# Altium schematic sheet BuckConverter.SchDoc
size A4; SheetNumber: 1; SheetTotal: 1
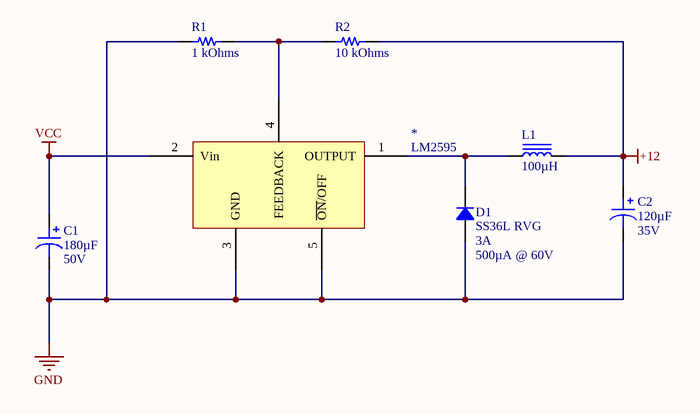
[diagram p0: BuckConverter.SchDoc]

## Parts
*  LM2595  [D2PAK]
C1  180µF  Voltage - Rated: 50V  [CAP ALSMD 8.3MM H10.5MM]
C2  120µF  Voltage - Rated: 35V  [CAP ALSMD 6.6MM H8.0MM]
D1  SS36L RVG  Current - Average Rectified (Io): 3A  Current - Reverse Leakage @ Vr: 500µA @ 60V  [SMF DO-219AB]
L1  100µH  [BOURNS SRR1280]
R1  1 kOhms  [RES 1206_3216]
R2  10 kOhms  [RES 1206_3216]

## Nets
+12: C2.1 L1.2 R2.2
GND: *.3(GND) *.5(~{ON}/OFF) C1.2 C2.2 D1.1 R1.1
VCC: *.2(Vin) C1.1
Net*_1: *.1(OUTPUT) D1.2 L1.1
Net*_4: *.4(FEEDBACK) R1.2 R2.1

## Library data of the parts
C1 = EEE-FK1H181SP: CAP ALUM 180UF 20% 50V SMD; Manufacturer: Panasonic Electronic Components; ESR (Equivalent Series Resistance): 340mOhm @ 100kHz; Lifetime @ Temp.: 2000 Hrs @ 105°C; Polarization: Polar; Ripple Current @ Low Frequency: 227.5mA @ 120Hz; Surface Mount Land Size: 0.327" L x 0.327" W (8.30mm x 8.30mm); Part Number: EEE-FK1H181SP; Applications: Automotive; Capacitance: 180µF; ComponentLink1Description: Datasheet; ComponentLink1URL: https://b2b-api.panasonic.eu/file_stream/pids/fileversion/3102; ComponentLink2Description: DigiKey Link; ComponentLink2URL: http://digikey.com/product-detail/en/panasonic-electronic-components/EEE-FK1H181SP/P18966CT-ND/5805073; Device Package: Radial, Can - SMD; Height - Seated (Max): 0.413" (10.50mm); LastUpdated: 2.09.2020 01:25:13; Lifecycle Status: Active; Minimum Order: 1; Mounting Type: Surface Mount; Operating Temperature: -55°C ~ 105°C; Package / Case: Radial, Can - SMD; Packaging: TapeAndReel; PartId: 7743; Part Status: Active; Price: 0.32; Ratings: AEC-Q200; Series: FKS; Size / Dimension: 0.315" Dia (8.00mm); Supplier 1: DigiKey; Supplier Part Number 1: P18966CT-ND; Tolerance: ±20%; Value: 180µF
C2 = EEE-FKV121XSP: CAP ALUM 120UF 20% 35V SMD; Manufacturer: Panasonic Electronic Components; ESR (Equivalent Series Resistance): 340mOhm @ 100kHz; Lifetime @ Temp.: 2000 Hrs @ 105°C; Polarization: Polar; Ripple Current @ Low Frequency: 182mA @ 120Hz; Surface Mount Land Size: 0.260" L x 0.260" W (6.60mm x 6.60mm); Part Number: EEE-FKV121XSP; Applications: Automotive; Capacitance: 120µF; ComponentLink1Description: Datasheet; ComponentLink1URL: https://b2b-api.panasonic.eu/file_stream/pids/fileversion/3102; ComponentLink2Description: DigiKey Link; ComponentLink2URL: http://digikey.com/product-detail/en/panasonic-electronic-components/EEE-FKV121XSP/P18961CT-ND/5805068; Device Package: Radial, Can - SMD; Height - Seated (Max): 0.315" (8.00mm); LastUpdated: 2.09.2020 01:25:38; Lifecycle Status: Active; Minimum Order: 1; Mounting Type: Surface Mount; Operating Temperature: -55°C ~ 105°C; Package / Case: Radial, Can - SMD; Packaging: TapeAndReel; PartId: 8391; Part Status: Active; Price: 0.20; Ratings: AEC-Q200; Series: FKS; Size / Dimension: 0.248" Dia (6.30mm); Supplier 1: DigiKey; Supplier Part Number 1: P18961CT-ND; Tolerance: ±20%; Value: 120µF
D1 = SS36L RVG: DIODE SCHOTTKY 60V 3A SUB SMA; Manufacturer: Taiwan Semiconductor Corporation; Speed: Fast Recovery =< 500ns, > 200mA (Io); Voltage - Forward (Vf) (Max) @ If: 750mV @ 3A; Part Number: SS36L RVG; ComponentLink1Description: Datasheet; ComponentLink1URL: https://www.taiwansemi.com/products/datasheet/SS34L%20SERIES_B14.pdf; ComponentLink2Description: DigiKey Link; ComponentLink2URL: http://digikey.com/product-detail/en/taiwan-semiconductor-corporation/SS36L-RVG/SS36LRVGCT-ND/7359628; Diode Type: Schottky; LastUpdated: 2.09.2020 01:23:14; Lifecycle Status: Active; Minimum Order: 1; Mounting Type: Surface Mount; Operating Temperature - Junction: -55°C ~ 150°C; Package / Case: DO-219AB; Packaging: TapeAndReel; PartId: 1287; Part Status: Active; Price: 0.11; Series: -; Supplier 1: DigiKey; Supplier Part Number 1: SS36LRVGCT-ND; Supplier Device Package: Sub SMA; Voltage - DC Reverse (Vr) (Max): 60V
L1 = SRR1280-101M: FIXED IND 100UH 2.1A 150MOHM SMD; Manufacturer: Bourns Inc.; Current - Saturation: 2A; DC Resistance (DCR): 150mOhm Max; Frequency - Self Resonant: 4.5MHz; Inductance Frequency - Test: 100kHz; Material - Core: Ferrite; Q @ Freq: 18 @ 796kHz; Shielding: Shielded; Tolerance: ±20%; Type: Wirewound; Part Number: SRR1280-101M; ComponentLink1Description: Datasheet; ComponentLink1URL: https://www.bourns.com/docs/Product-Datasheets/SRR1280.pdf; ComponentLink2Description: DigiKey Link; ComponentLink2URL: http://digikey.com/product-detail/en/bourns-inc/SRR1280-101M/SRR1280-101MCT-ND/2127046; Current Rating (Amps): 2.1A; Device Package: Nonstandard; Height - Seated (Max): 0.315" (8.00mm); Inductance: 100µH; LastUpdated: 2.09.2020 01:22:09; Lifecycle Status: Active; Minimum Order: 1; Mounting Type: Surface Mount; Operating Temperature: -40°C ~ 125°C; Package / Case: Nonstandard; Packaging: TapeAndReel; PartId: 24; Part Status: Active; Price: 0.65; Series: SRR1280; Size / Dimension: 0.492" L x 0.492" W (12.50mm x 12.50mm); Supplier 1: DigiKey; Supplier Part Number 1: SRR1280-101MCT-ND; Value: 100µH
R1 = RNCP1206FTD1K00: RES 1K OHM 1% 1/2W 1206; Manufacturer: Stackpole Electronics Inc; Power (Watts): 0.5W, 1/2W; Temperature Coefficient: ±100ppm/°C; Part Number: RNCP1206FTD1K00; ComponentLink1Description: Datasheet; ComponentLink1URL: https://www.seielect.com/catalog/sei-rncp.pdf; ComponentLink2Description: DigiKey Link; ComponentLink2URL: http://digikey.com/product-detail/en/stackpole-electronics-inc/RNCP1206FTD1K00/RNCP1206FTD1K00CT-ND/2240675; Composition: Thin Film; Device Package: 1206 (3216 Metric); Features: Anti-Sulfur, Moisture Resistant; Height - Seated (Max): 0.024" (0.60mm); LastUpdated: 2.09.2020 01:13:10; Lifecycle Status: Active; Minimum Order: 1; Number of Terminations: 2; Operating Temperature: -55°C ~ 155°C; Package / Case: 1206 (3216 Metric); Packaging: TapeAndReel; PartId: 26970; Part Status: Active; Price: 0.01; Resistance: 1 kOhms; Series: RNCP; Size / Dimension: 0.122" L x 0.059" W (3.10mm x 1.50mm); Supplier 1: DigiKey; Supplier Part Number 1: RNCP1206FTD1K00CT-ND; Supplier Device Package: 1206; Tolerance: ±1%; Value: 1 kOhms
R2 = CRGCQ1206F10K: CRGCQ 1206 10K 1%; Manufacturer: TE Connectivity Passive Product; Power (Watts): 0.25W, 1/4W; Temperature Coefficient: ±100ppm/°C; Part Number: CRGCQ1206F10K; ComponentLink1Description: Datasheet; ComponentLink1URL: https://www.te.com/commerce/DocumentDelivery/DDEController?Action=srchrtrv&DocNm=1773204-3&DocType=DS&DocLang=English; ComponentLink2Description: DigiKey Link; ComponentLink2URL: http://digikey.com/product-detail/en/te-connectivity-passive-product/CRGCQ1206F10K/A129822CT-ND/8577654; Composition: Thick Film; Device Package: 1206 (3216 Metric); Features: Automotive AEC-Q200, Moisture Resistant; Height - Seated (Max): 0.026" (0.65mm); LastUpdated: 2.09.2020 01:13:10; Lifecycle Status: Active; Minimum Order: 1; Number of Terminations: 2; Operating Temperature: -55°C ~ 155°C; Package / Case: 1206 (3216 Metric); Packaging: TapeAndReel; PartId: 27005; Part Status: Active; Price: 0.01; Ratings: AEC-Q200; Resistance: 10 kOhms; Series: CRGCQ; Size / Dimension: 0.122" L x 0.061" W (3.10mm x 1.55mm); Supplier 1: DigiKey; Supplier Part Number 1: A129822CT-ND; Supplier Device Package: 1206; Tolerance: ±1%; Value: 10 kOhms